# EAGLE schematic roomba_main_pcb_v1 (EAGLE 9.5.2)
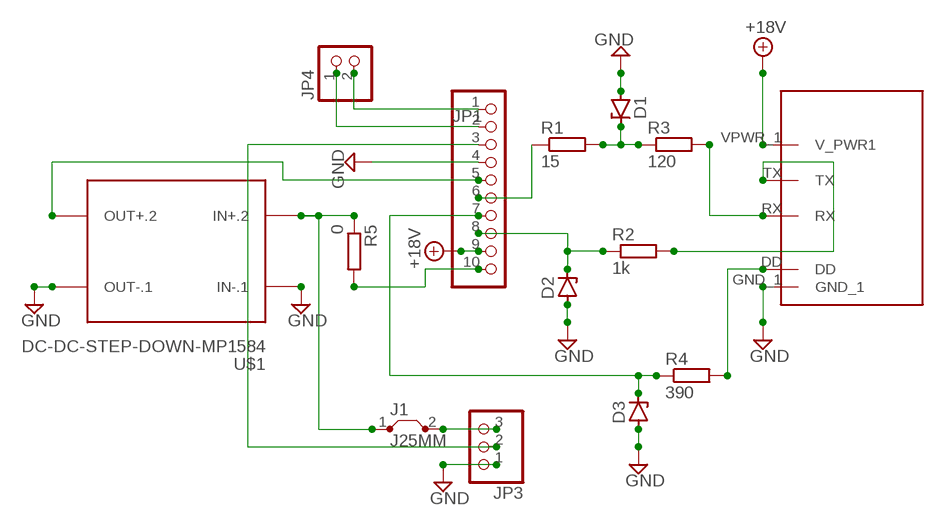
[diagram p0: schematic, sheet 1]

## Parts
D1  ZENER-DIODESOD80C  [SOD80C]
D2  ZENER-DIODESOD80C  [SOD80C]
D3  ZENER-DIODESOD80C  [SOD80C]
J1  J25MM  [25]
JP1  PINHD-1X10/90  [1X10/90]
JP3  PINHD-1X3  [1X03]
JP4  PINHD-1X2  [1X02]
R1  15  R-EU_M1206  [M1206]
R2  1k  R-EU_M1206  [M1206]
R3  120  R-EU_M1206  [M1206]
R4  390  R-EU_M1206  [M1206]
R5  0  R-EU_M1206  [M1206]
U$1  DC-DC-STEP-DOWN-MP1584  [DC-DC-STEP-DOWN-MP1584]
U$3  7_PIN  [PIN-7]

## Nets
+18V: JP1.9 U$3.VPWR_1(V_PWR1)
GND: D1.A D2.A D3.A JP1.4 JP3.1 U$1.IN-.1 U$1.OUT-.1 U$3.GND_1
N$1: D3.C JP1.7 R4.1
N$3: D2.C JP1.8 R2.1
N$4: J1.1 R5.1 U$1.IN+.2
N$5: R4.2 U$3.DD
N$6: J1.2 JP3.3
N$7: R3.2 U$3.RX
N$8: D1.C R1.2 R3.1
N$9: R2.2 U$3.TX
N$10: JP1.5 U$1.OUT+.2
N$11: JP1.10 R5.2
N$12: JP1.3 JP3.2
N$13: JP1.1 JP4.2
N$14: JP1.6 R1.1
N$15: JP1.2 JP4.1

## Library data of the parts
D1-D3 = diode:ZENER-DIODE: Z-Diode
J1 = jumper:J: Bridge
JP1 = pinhead:PINHD-1X10: PIN HEADER
JP3 = pinhead:PINHD-1X3: PIN HEADER
JP4 = pinhead:PINHD-1X2: PIN HEADER
R1-R5 = rcl:R-EU_: RESISTOR, European symbol; SPICEPREFIX: R
U$1 = diy-modules:DC-DC-STEP-DOWN-MP1584: DC/DC Step-Down Regulator based on MP1584 chip MP1584 datasheet available here: http://www.haoyuelectronics.com/Attachment/MP1584/MP1584.pdf Click here to find device on ebay.com <http://www.ebay.com/sch/mp1584+module>
U$3 = M_wifi:7_PIN